# Altium schematic sheet main.SchDoc
size 209 x 297 mm; Address1: Address1; Address2: Address2; Address3: Address3; Address4: Address4; SheetNumber: 1; SheetTotal: 1; Scale: 1:1; Разраб.: Михаил Каа; Обозначение документа: ZX_CARTRIDGE.002 Э3; Номер листа: 1; Общее количество листов: 1; Наименование организации: Михаил Каа; Наименование изделия 1: zx cartridge (Дельта); Наименование изделия 2: Схема электрическая; Наименование изделия 3: принципиальная; Нач. отд.: Нач. отд.
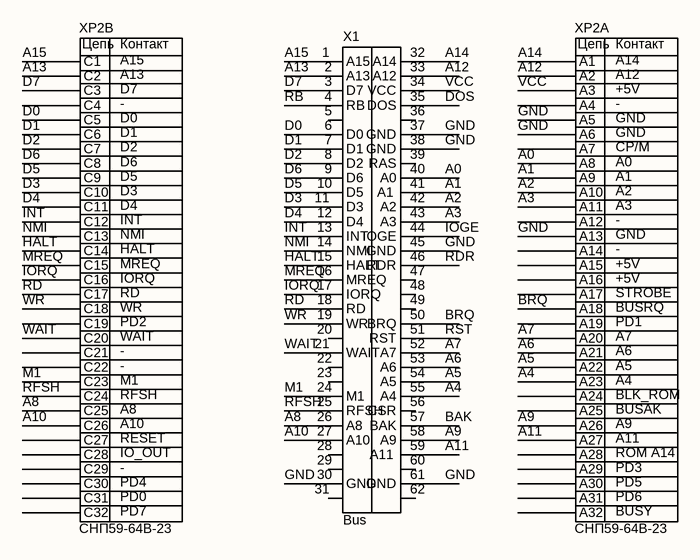
[diagram p0: main.SchDoc]

## Parts
X1  Bus  [BUS]
XP2  СНП59-64В-23  [delta-host]  (parts A,B of 2)

## Nets
A0: X1.40(A0) XP2.A8
A1: X1.41(A1) XP2.A9
A2: X1.42(A2) XP2.A10
A3: X1.43(A3) XP2.A11
A4: X1.55(A4) XP2.A23
A5: X1.54(A5) XP2.A22
A6: X1.53(A6) XP2.A21
A7: X1.52(A7) XP2.A20
A8: X1.26(A8) XP2.C25
A9: X1.58(A9) XP2.A26
A10: X1.27(A10) XP2.C26
A11: X1.59(A11) XP2.A27
A12: X1.33(A12) XP2.A2
A13: X1.2(A13) XP2.C2
A14: X1.32(A14) XP2.A1
A15: X1.1(A15) XP2.C1
BAK: X1.57(BAK)
BRQ: X1.50(BRQ) XP2.A18
D0: X1.6(D0) XP2.C5
D1: X1.7(D1) XP2.C6
D2: X1.8(D2) XP2.C7
D3: X1.11(D3) XP2.C10
D4: X1.12(D4) XP2.C11
D5: X1.10(D5) XP2.C9
D6: X1.9(D6) XP2.C8
D7: X1.3(D7) XP2.C3
DOS: X1.35(DOS)
GND: X1.30(GND) X1.37(GND) X1.38(GND) X1.45(GND) X1.61(GND) XP2.A5 XP2.A6 XP2.A13
HALT: X1.15(HALT) XP2.C14
INT: X1.13(INT) XP2.C12
IOGE: X1.44(IOGE)
IORQ: X1.17(IORQ) XP2.C16
M1: X1.24(M1) XP2.C23
MREQ: X1.16(MREQ) XP2.C15
NMI: X1.14(NMI) XP2.C13
RB: X1.4(RB)
RD: X1.18(RD) XP2.C17
RDR: X1.46(RDR)
RFSH: X1.25(RFSH) XP2.C24
RST: X1.51(RST)
VCC: X1.34(VCC) XP2.A3
WAIT: X1.21(WAIT) XP2.C20
WR: X1.19(WR) XP2.C18

Not connected (* = marked no-connect by the designer): X1 5 20 22 23 28 29 31 36 39(RAS) 47 48 49 56(CSR) 60 62; XP2 A4 A7 A12 A14 A15 A16 A17 A19 A24 A25 A28 A29 A30 A31 A32 C4 C19 C21 C22 C27 C28 C29 C30 C31 C32

## Notes on the sheet
- Перв. примен.
- Справ. №
- Подп. и дата
- Инв. № дубл.
- Взам. инв. №
- Разраб.
- Изм.
- Лист
- № докум.
- Подп.
- Лит.
- Масса
- Масштаб
- Пров.
- Т.контр.
- Листов
- Инв. № подл.
- Утв.
- Н.контр.
- Копировал
- Формат А4
- (in symbol СНП59-64В-23, part A) Цепь; Контакт; +5V; -; GND; CP/M; A0; STROBE; BUSRQ; PD1; BLK_ROM; BUSAK; ROM A14; PD3; PD5; PD6; BUSY
- (in symbol СНП59-64В-23, part B) Цепь; Контакт; D7; -; D0; D1; D2; D6; D5; D3; D4; INT; NMI; HALT; MREQ; IORQ; RD; WR; PD2; WAIT; M1; RFSH; RESET; IO_OUT; PD4; PD0; PD7

## Library data of the parts
XP2 = СНП59-64В-23: Value: *